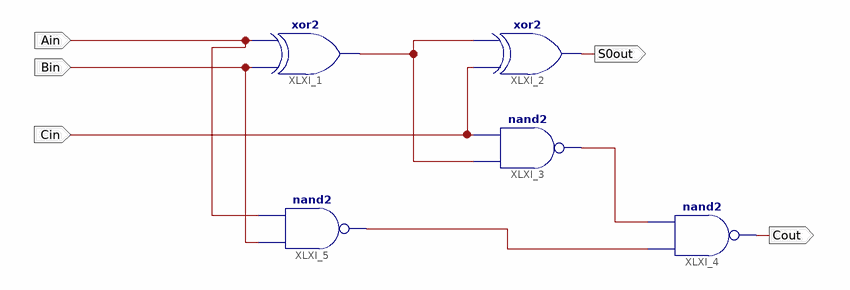
[diagram p0: schematic sheet 1]
// Xilinx ISE schematic FA.sch (spartan3e) as structural Verilog: 5 symbols, 5 ports
module FA (
  input  Ain,
  input  Bin,
  input  Cin,
  output S0out,
  output Cout
);

  wire XLXN_6, XLXN_10, XLXN_11;

  xor XLXI_1 (XLXN_6, Bin, Ain);
  xor XLXI_2 (S0out, Cin, XLXN_6);
  nand XLXI_3 (XLXN_10, XLXN_6, Cin);
  nand XLXI_4 (Cout, XLXN_11, XLXN_10);
  nand XLXI_5 (XLXN_11, Bin, Ain);
endmodule
